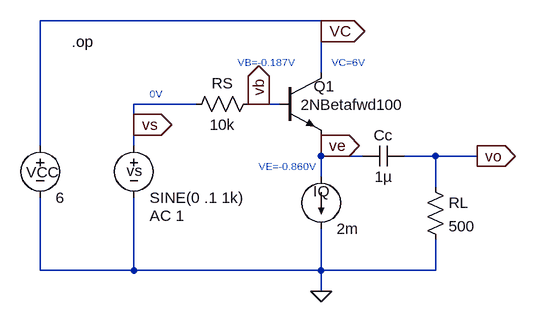
[diagram p0: schematic prob6_48_VCC6V_Beta120_RL500.asc]
prob6_48_VCC6V_Beta120_RL500.asc, the LTspice schematic file:
Version 4
SHEET 1 880 680
WIRE 208 48 -224 48
WIRE 208 64 208 48
WIRE 208 128 208 64
WIRE 16 176 -80 176
WIRE 112 176 96 176
WIRE 144 176 112 176
WIRE -80 208 -80 176
WIRE -224 240 -224 48
WIRE -80 240 -80 208
WIRE 208 240 208 224
WIRE 208 256 208 240
WIRE 272 256 208 256
WIRE 384 256 336 256
WIRE 448 256 384 256
WIRE 208 288 208 256
WIRE 384 304 384 256
WIRE -224 432 -224 320
WIRE -80 432 -80 320
WIRE -80 432 -224 432
WIRE 208 432 208 368
WIRE 208 432 -80 432
WIRE 384 432 384 384
WIRE 384 432 208 432
WIRE 208 464 208 432
FLAG 208 464 0
FLAG 448 256 vo
IOPIN 448 256 Out
FLAG 112 176 vb
IOPIN 112 176 Out
FLAG 208 240 ve
IOPIN 208 240 Out
FLAG -80 208 vs
IOPIN -80 208 Out
FLAG 208 64 VC
IOPIN 208 64 Out
SYMBOL npn 144 128 R0
WINDOW 0 53 21 Left 2
WINDOW 3 33 49 Left 2
SYMATTR InstName Q1
SYMATTR Value 2NBetafwd100
SYMBOL voltage -80 224 R0
WINDOW 0 -11 55 Left 2
WINDOW 123 24 124 Left 2
WINDOW 39 0 0 Left 0
SYMATTR InstName vs
SYMATTR Value SINE(0 .1 1k)
SYMATTR Value2 AC 1
SYMBOL voltage -224 224 R0
WINDOW 0 -22 57 Left 2
SYMATTR InstName VCC
SYMATTR Value 6
SYMBOL res 368 288 R0
SYMATTR InstName RL
SYMATTR Value 500
SYMBOL res 112 160 R90
WINDOW 0 0 56 VBottom 2
WINDOW 3 32 56 VTop 2
SYMATTR InstName RS
SYMATTR Value 10k
SYMBOL cap 336 240 R90
WINDOW 0 0 32 VBottom 2
WINDOW 3 32 32 VTop 2
SYMATTR InstName Cc
SYMATTR Value 1µ
SYMBOL current 208 288 R0
WINDOW 0 -12 22 Left 2
SYMATTR InstName IQ
SYMATTR Value 2m
TEXT -176 80 Left 2 !.op
TEXT 224 112 Left 1 ;VC=6V
TEXT 80 112 Left 1 ;VB=-0.187V
TEXT 112 272 Left 1 ;VE=-0.860V
TEXT -56 160 Left 1 ;0V

The netlist it stands for:
* prob6_48_VCC6V_Beta120_RL500.asc
Q1 VC vb ve 0 2NBetafwd100
vs vs 0 SINE(0 .1 1k) AC 1
VCC VC 0 6
RL vo 0 500
RS vb vs 10k
Cc vo ve 1µ
IQ ve 0 2m
.model NPN NPN
.model PNP PNP
.lib standard.bjt
.op
* VC=6V
* VB=-0.187V
* VE=-0.860V
* 0V
.backanno
.end